# Altium schematic sheet Temp.SchDoc: Temperature sensor
size A4; SheetNumber: 5; SheetTotal: 10; Project: WSN Z1; Comments: Temperatire sensor
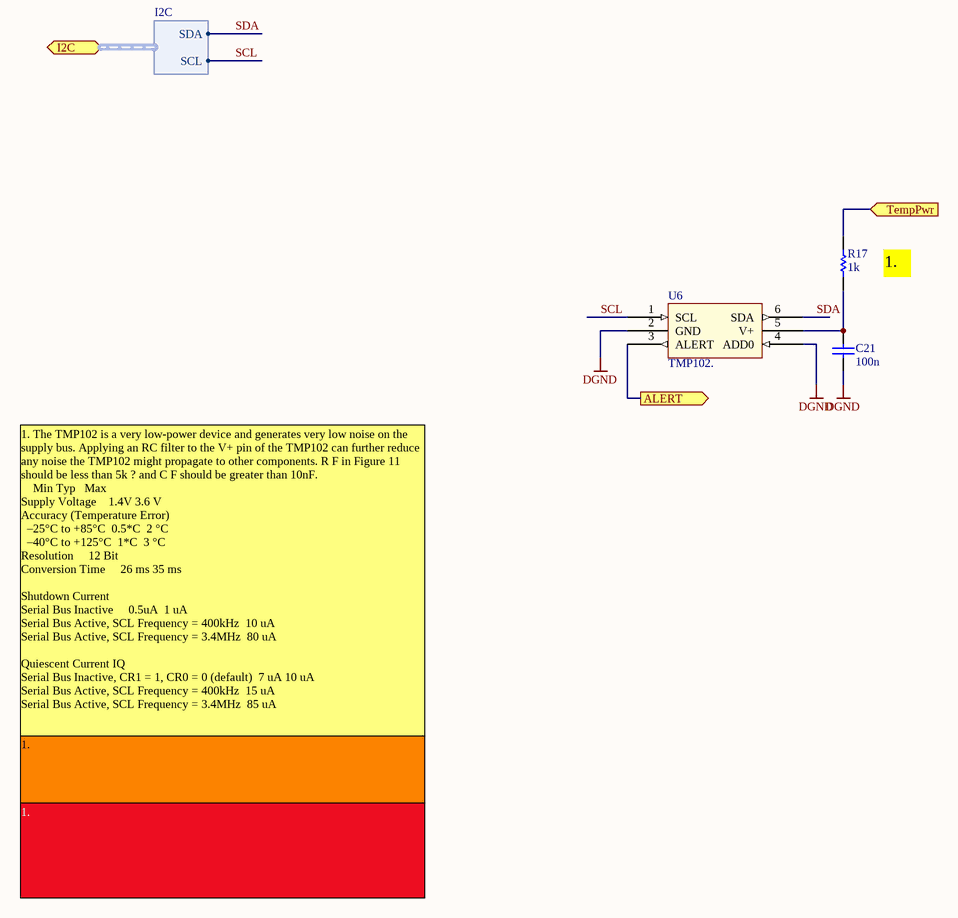
[diagram p0: Temp.SchDoc]

## Parts
C21  value 100n  [CC-0402-AL]  (hidden comment: Cap Semi)
R17  value 1k  [CR-0402-AL]  (hidden comment: Res Semi)
U6  TMP102.  [SOT-TMP102]

## Ports
ALERT (out), I2C (harness I2C), TempPwr (in)

## Harnesses
I2C: SCL, SDA

## Nets
DGND: C21.2 U6.2(GND) U6.4(ADD0)
ALERT: U6.3(ALERT) ; port ALERT
SCL: U6.1(SCL) ; port I2C.SCL
SDA: U6.6(SDA) ; port I2C.SDA
TempPwr: R17.2 ; port TempPwr
NetC21_1: C21.1 R17.1 U6.5(V+)

## Notes on the sheet
- (near R17) 1.
- 1. The TMP102 is a very low-power device and generates very low noise on the supply bus. Applying an RC filter to the V+ pin of the TMP102 can further reduce any noise the TMP102 might propagate to other components. R F in Figure 11 should be less than 5k ? and C F should be greater than 10nF.
  Min	Typ  	Max
  Supply Voltage 			1.4V	3.6 V
  Accuracy (Temperature Error)
  –25°C to +85°C		0.5*C 	2 °C
  –40°C to +125°C		1*C 	3 °C
  Resolution 				12 Bit
  Conversion Time 				26 ms	35 ms
  Shutdown Current
  Serial Bus Inactive 				0.5uA 	1 uA
  Serial Bus Active, SCL Frequency = 400kHz 	10 uA
  Serial Bus Active, SCL Frequency = 3.4MHz 	80 uA
  Quiescent Current IQ
  Serial Bus Inactive, CR1 = 1, CR0 = 0 (default) 	7 uA	10 uA
  Serial Bus Active, SCL Frequency = 400kHz 	15 uA
  Serial Bus Active, SCL Frequency = 3.4MHz 	85 uA
- 1.

## Library data of the parts
C21 = Cap Semi: Capacitor (Semiconductor SIM Model)
R17 = Res Semi: Semiconductor Resistor; Manufacturer: Generic Components
U6 = TMP102: Low Power Digital Temperature Sensor  With SMBus /Two-Wire Serial Interface in SOT563. Voltage Supply 1.4 V ~ 3.6 V